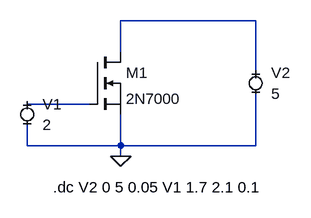
[diagram p0: schematic Draft3.asc]
Draft3.asc, the LTspice schematic file:
Version 4
SHEET 1 880 680
WIRE 432 80 224 80
WIRE 224 128 224 80
WIRE 432 160 432 80
WIRE 176 208 80 208
WIRE 80 272 80 240
WIRE 224 272 224 224
WIRE 224 272 80 272
WIRE 432 272 432 192
WIRE 432 272 224 272
WIRE 224 288 224 272
FLAG 224 288 0
SYMBOL nmos 176 128 R0
SYMATTR InstName M1
SYMATTR Value 2N7000
SYMBOL MiniSyms4\\voltage- 432 176 R0
WINDOW 123 0 0 Left 2
WINDOW 39 0 0 Left 2
SYMATTR InstName V2
SYMATTR Value 5
SYMBOL MiniSyms4\\voltage- 80 224 R0
WINDOW 123 0 0 Left 2
WINDOW 39 0 0 Left 2
SYMATTR InstName V1
SYMATTR Value 2
TEXT 120 336 Left 2 !.dc V2 0 5 0.05 V1 1.7 2.1 0.1

The netlist it stands for:
* Draft3.asc
M1 N001 N002 0 0 2N7000
V2 N001 0 5
V1 N002 0 2
.model NMOS NMOS
.model PMOS PMOS
.lib standard.mos
.dc V2 0 5 0.05 V1 1.7 2.1 0.1
.backanno
.end